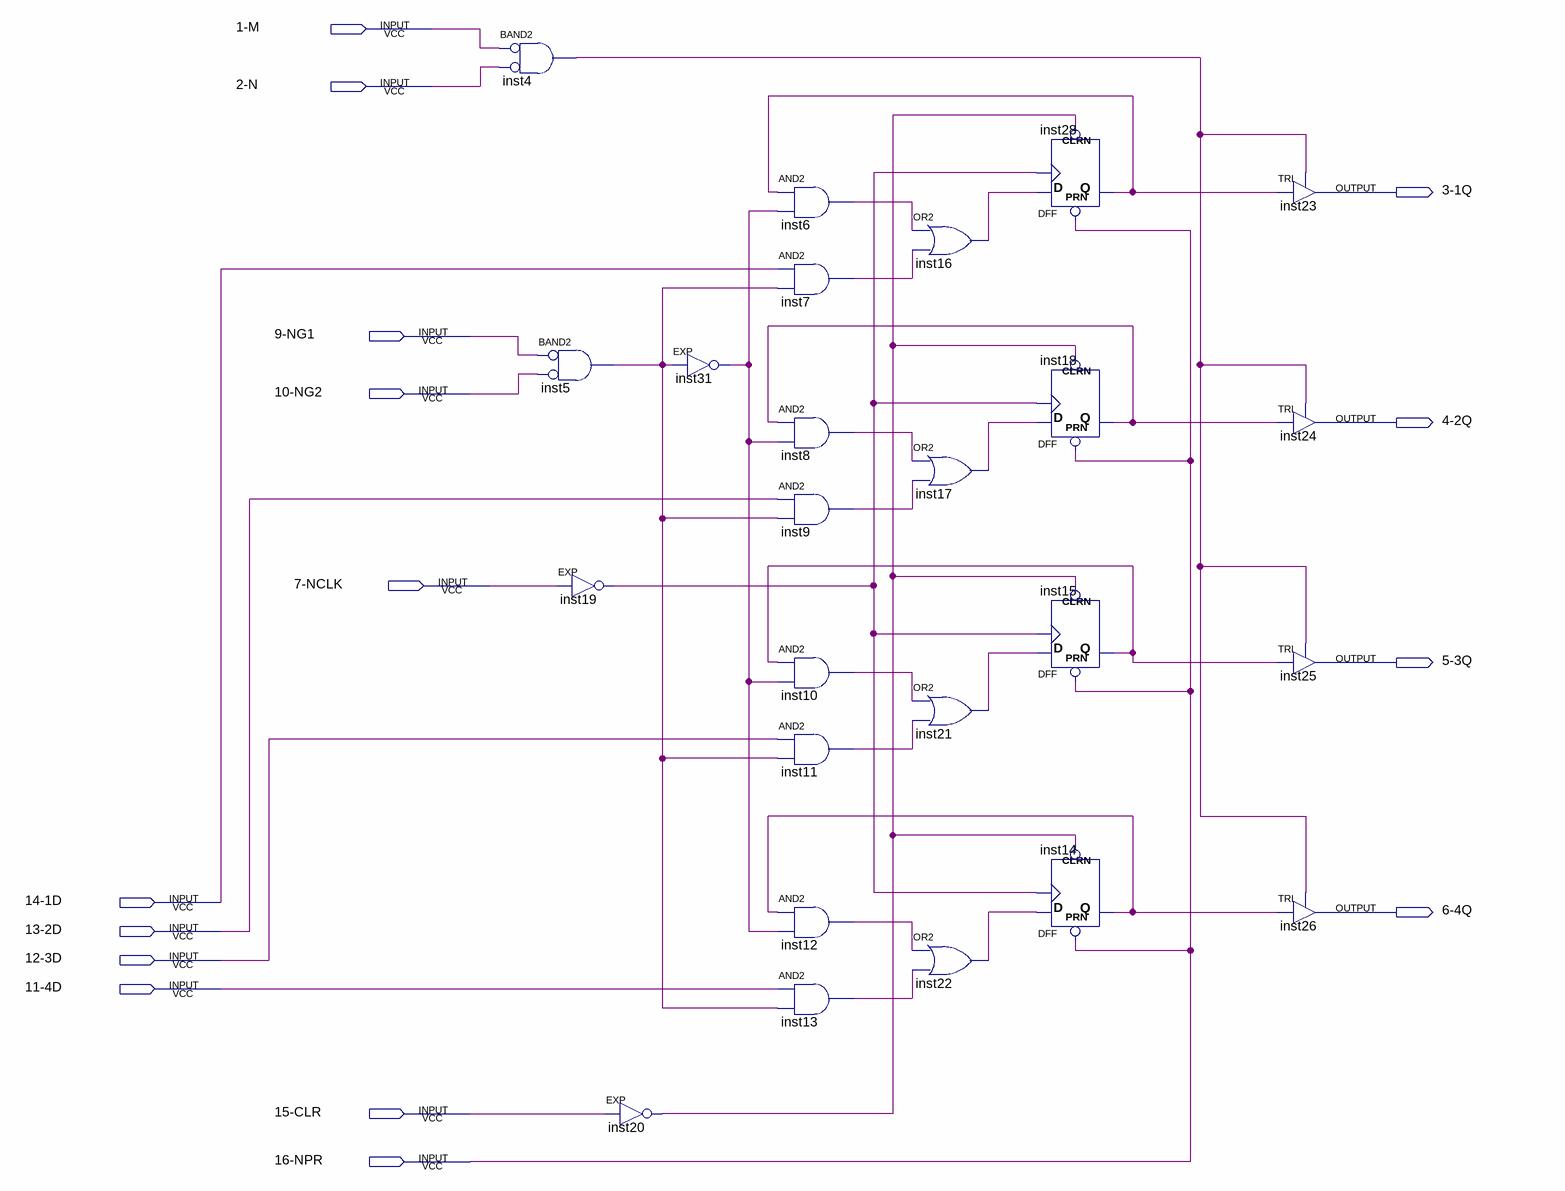
[diagram p0: schematic sheet]
// Quartus schematic 74ls173.bdf as structural Verilog: 25 symbols, 15 pins
module \74ls173  (
  input  \1-M ,
  input  \2-N ,
  input  \9-NG1 ,
  input  \10-NG2 ,
  input  \7-NCLK ,
  input  \14-1D ,
  input  \13-2D ,
  input  \12-3D ,
  input  \11-4D ,
  input  \15-CLR ,
  input  \16-NPR ,
  output \3-1Q ,
  output \4-2Q ,
  output \5-3Q ,
  output \6-4Q 
);

  wire inst4_out, inst5_out, inst6_out, inst7_out, inst8_out, inst9_out, inst10_out, inst11_out, inst12_out,
       inst13_out, inst14_q, inst15_q, inst16_out, inst17_out, inst18_q, inst19_out, inst20_out, inst21_out,
       inst22_out, inst28_q, inst31_out;

  and inst4 (inst4_out, ~\1-M , ~\2-N );  // BAND2
  and inst5 (inst5_out, ~\9-NG1 , ~\10-NG2 );  // BAND2
  EXP inst19 (.IN(\7-NCLK ), .OUT(inst19_out));
  EXP inst31 (.IN(inst5_out), .OUT(inst31_out));
  EXP inst20 (.IN(\15-CLR ), .OUT(inst20_out));
  and inst6 (inst6_out, inst28_q, inst31_out);
  and inst7 (inst7_out, \14-1D , inst5_out);
  and inst8 (inst8_out, inst18_q, inst31_out);
  and inst9 (inst9_out, \13-2D , inst5_out);
  and inst10 (inst10_out, inst15_q, inst31_out);
  and inst11 (inst11_out, \12-3D , inst5_out);
  and inst12 (inst12_out, inst14_q, inst31_out);
  and inst13 (inst13_out, \11-4D , inst5_out);
  or inst16 (inst16_out, inst6_out, inst7_out);
  or inst17 (inst17_out, inst8_out, inst9_out);
  or inst21 (inst21_out, inst10_out, inst11_out);
  or inst22 (inst22_out, inst12_out, inst13_out);
  DFF inst28 (.CLRN(inst20_out), .CLK(inst19_out), .D(inst16_out), .PRN(\16-NPR ), .Q(inst28_q));
  DFF inst18 (.CLRN(inst20_out), .CLK(inst19_out), .D(inst17_out), .PRN(\16-NPR ), .Q(inst18_q));
  DFF inst15 (.CLRN(inst20_out), .CLK(inst19_out), .D(inst21_out), .PRN(\16-NPR ), .Q(inst15_q));
  DFF inst14 (.CLRN(inst20_out), .CLK(inst19_out), .D(inst22_out), .PRN(\16-NPR ), .Q(inst14_q));
  TRI inst23 (.IN(inst28_q), .OE(inst4_out), .OUT(\3-1Q ));
  TRI inst24 (.IN(inst18_q), .OE(inst4_out), .OUT(\4-2Q ));
  TRI inst25 (.IN(inst15_q), .OE(inst4_out), .OUT(\5-3Q ));
  TRI inst26 (.IN(inst14_q), .OE(inst4_out), .OUT(\6-4Q ));
endmodule
